# EAGLE schematic Oscillator_ASTX-H11 (EAGLE 6.5.0)
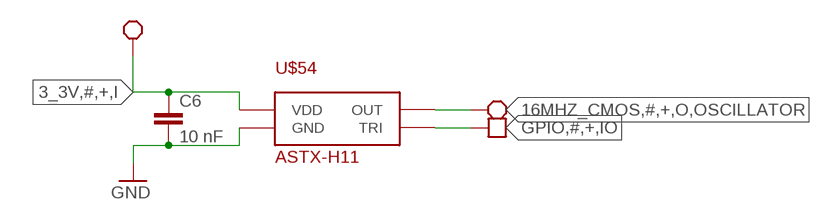
[diagram p0: schematic, sheet 1]

## Parts
C6  10 nF  C-EUC0402  [C0402]
U$54  ASTX-H11  [ASTX-H11]

## Nets
3_3V,#,+,I: C6.1 U$54.P$4(VDD) ; supply symbol labelled BLOCK_REQUIREMENT
16MHZ_CMOS,#,+,O,OSCILLATOR: U$54.P$3(OUT) ; supply symbol labelled BLOCK_REQUIREMENT
GND: C6.2 U$54.P$2(GND)
GPIO,#,+,IO: U$54.P$1(TRI) ; supply symbol labelled BLOCK_OPTIONAL

## Library data of the parts
C6 = rcl:C-EU: CAPACITOR, European symbol
U$54 = block_parts:ASTX-H11